# Altium project Gestus.PrjPcb
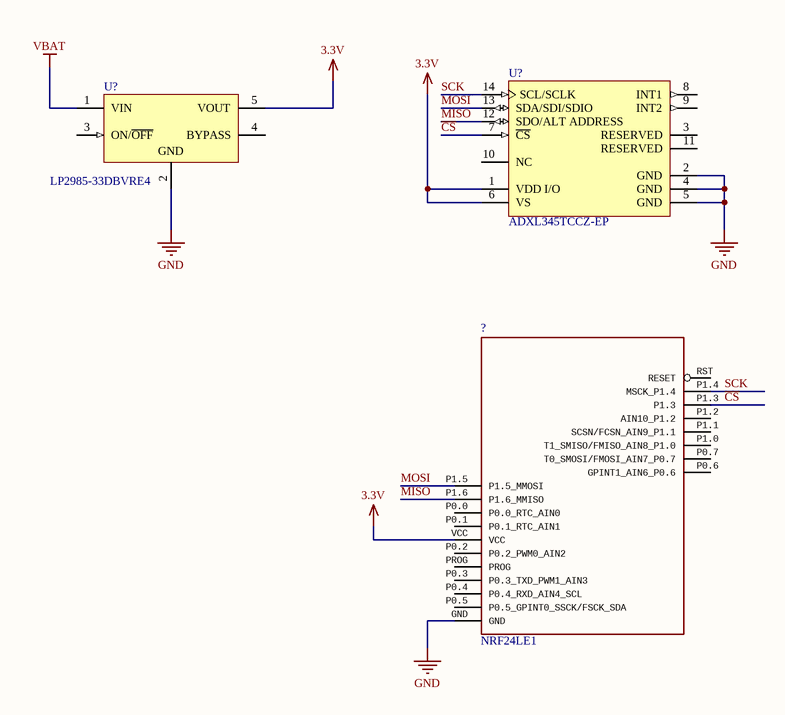
[diagram p0: ruka.SchDoc]
1 sheet, 3 parts. Net scope: global (net labels, ports and power ports of the same name join across sheets).

## Sheet ruka.SchDoc
size A4

### Parts
(Parts that share a designator on the sheet are numbered #1, #2 ... from top to bottom, then left to right.)
?  NRF24LE1  [SMDNRF]
U?#1  ADXL345TCCZ-EP  [ADI-CC-14-1_V]
U?#2  LP2985-33DBVRE4  [TI-DBV5_V]

### Nets
3.3V: ?.VCC U?#1.1(VDD_I/O) U?#1.6(VS) U?#2.5(VOUT)
GND: ?.GND U?#1.2(GND) U?#1.4(GND) U?#1.5(GND) U?#2.2(GND)
VBAT: U?#2.1(VIN)
~{CS}: ?.P1.3 U?#1.7(~{CS})
MISO: ?.P1.6(P1.6_MMISO) U?#1.12(SDO/ALT_ADDRESS)
MOSI: ?.P1.5(P1.5_MMOSI) U?#1.13(SDA/SDI/SDIO)
SCK: ?.P1.4(MSCK_P1.4) U?#1.14(SCL/SCLK)

Not connected (* = marked no-connect by the designer): ? P0.0(P0.0_RTC_AIN0) P0.1(P0.1_RTC_AIN1) P0.2(P0.2_PWM0_AIN2) P0.3(P0.3_TXD_PWM1_AIN3) P0.4(P0.4_RXD_AIN4_SCL) P0.5(P0.5_GPINT0_SSCK/FSCK_SDA) P0.6(GPINT1_AIN6_P0.6) P0.7(T0_SMOSI/FMOSI_AIN7_P0.7) P1.0(T1_SMISO/FMISO_AIN8_P1.0) P1.1(SCSN/FCSN_AIN9_P1.1) P1.2(AIN10_P1.2) PROG RST(RESET); U?#1 3(RESERVED) 8(INT1) 9(INT2) 10(NC) 11(RESERVED); U?#2 3(ON/~{OFF}) 4(BYPASS)

### Library data of the parts
U?#1 = CMP-0885-00034-1: 3-Axis, +/-2 g / +/-4 g / +/-8 g / +/-16 g Digital Accelerometer with Digital Output, 1.6 KHz BW, Industrial, 14-pin LGA, Tray; Manufacturer: Analog Devices; Supply Current: 140 uA; -3dB Bandwidth: 1.6 KHz; Voltage Supply (V): 2.0 to 3.6; # of Axes: 3; Sensitivity: 256/128/64/32 LSB/g; DatasheetVersion: Rev. A; ComponentLink3URL: http://www.analog.com/static/imported-files/data_sheets/ADXL343.pdf; PackageDescription: 14-Pin Land Grid Array, 3 x 5 mm Body, 0.8 mm Pitch; PartNumber: ADXL345TCCZ-EP; PackageVersion: 03-16-2010-A, 03/2010; Packing: Tray; ComponentLink1Description: Manufacturer URL; ComponentLink2Description: Datasheet; ComponentLink2URL: http://www.analog.com/static/imported-files/data_sheets/ADXL345-EP.pdf; PackageReference: CC-14-1; ComponentLink4Description: Product URL; ComponentLink4URL: http://www.analog.com/en/mems-sensors/mems-inertial-sensors/adxl345/products/product.html; Mounting Technology: Surface Mount; Output Type: Digital; ComponentLink1URL: http://www.analog.com/en/index.html; ComponentLink3Description: Package Specification
U?#2 = CMP-0758-00029-1: Single Output Low Noise LDO, 150 mA, Fixed 3.3 V Output, 1.5% Tolerance, 2.2 to 16 V Input, Low IQ, 5-Pin SOT-23 (DBV), -40 to 125 degC, Green (RoHS & no Sb/Br), Tape and Reel; Manufacturer: Texas Instruments; Iout (Max) (A): 0.15; Output Options: Fixed Output; Fixed Output Options (V): 3.3; Vdo (Typ) (mV): 280; Accuracy (%): 1.5; Iq (Typ) (mA): 0.85; DatasheetVersion: SLVS522N; ComponentLink3URL: http://www.ti.com/litv/pdf/mpds018j; PackageDescription: 5-Pin Plastic Small Outline, Body 2.9 x 1.6 mm, Pitch 0.95 mm; PackageReference: DBV5; ComponentLink2URL: http://www.ti.com/lit/ds/symlink/lp2985-50.pdf; ComponentLink3Description: Package Specification; ComponentLink1URL: http://www.ti.com/; Operating Temperature Range (degC): -40 to 125; Mounting Technology: Surface Mount; PackageVersion: 4073253-4/L; ComponentLink2Description: Datasheet; ComponentLink1Description: Manufacturer URL; Packing: Tape and Reel; PartNumber: LP2985-33DBVRE4; Vin (V): 2.2 to 16; RoHS: TRUE